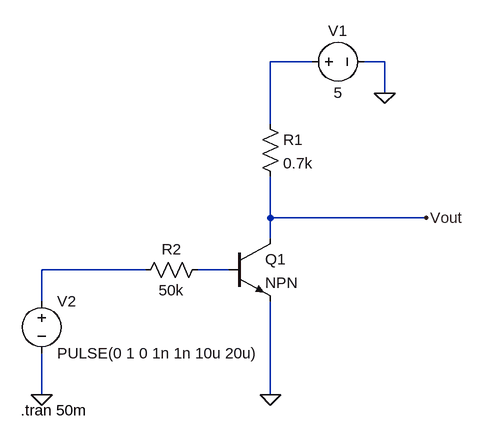
[diagram p0: schematic BJTTransistorSwitch.asc]
BJTTransistorSwitch.asc, the LTspice schematic file:
Version 4.1
SHEET 1 880 680
WIRE 384 -128 320 -128
WIRE 496 -128 464 -128
WIRE 496 -80 496 -128
WIRE 320 -32 320 -128
WIRE 320 112 320 48
WIRE 560 112 320 112
WIRE 320 144 320 112
WIRE 128 192 -32 192
WIRE 256 192 208 192
WIRE -32 240 -32 192
WIRE -32 384 -32 320
WIRE 320 384 320 240
FLAG 496 -80 0
FLAG 320 384 0
FLAG -32 384 0
FLAG 560 112 Vout
SYMBOL res 304 -48 R0
SYMATTR InstName R1
SYMATTR Value 0.7k
SYMBOL voltage 368 -128 R270
WINDOW 0 32 56 VTop 2
WINDOW 3 -32 56 VBottom 2
WINDOW 123 0 0 Left 0
WINDOW 39 0 0 Left 0
SYMATTR InstName V1
SYMATTR Value 5
SYMBOL res 224 176 R90
WINDOW 0 0 56 VBottom 2
WINDOW 3 32 56 VTop 2
SYMATTR InstName R2
SYMATTR Value 50k
SYMBOL npn 256 144 R0
SYMATTR InstName Q1
SYMBOL voltage -32 224 R0
WINDOW 123 0 0 Left 0
WINDOW 39 0 0 Left 0
SYMATTR InstName V2
SYMATTR Value PULSE(0 1 0 1n 1n 10u 20u)
TEXT -64 408 Left 2 !.tran 50m

The netlist it stands for:
* BJTTransistorSwitch.asc
R1 N001 Vout 0.7k
V1 N001 0 5
R2 N003 N002 50k
Q1 Vout N003 0 0 NPN
V2 N002 0 PULSE(0 1 0 1n 1n 10u 20u)
.model NPN NPN
.model PNP PNP
.lib standard.bjt
.tran 50m
.backanno
.end